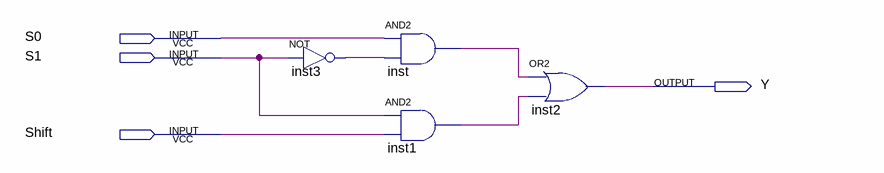
[diagram p0: schematic sheet]
// Quartus schematic mux21.bdf as structural Verilog: 4 symbols, 4 pins
module mux21 (
  input  S0,
  input  S1,
  input  Shift,
  output Y
);

  wire inst1_out, inst3_out, inst_out;

  not inst3 (inst3_out, S1);
  and inst (inst_out, S0, inst3_out);
  and inst1 (inst1_out, S1, Shift);
  or inst2 (Y, inst_out, inst1_out);
endmodule
